# EAGLE design SwitchDemoElectron (EAGLE 9.4.0)
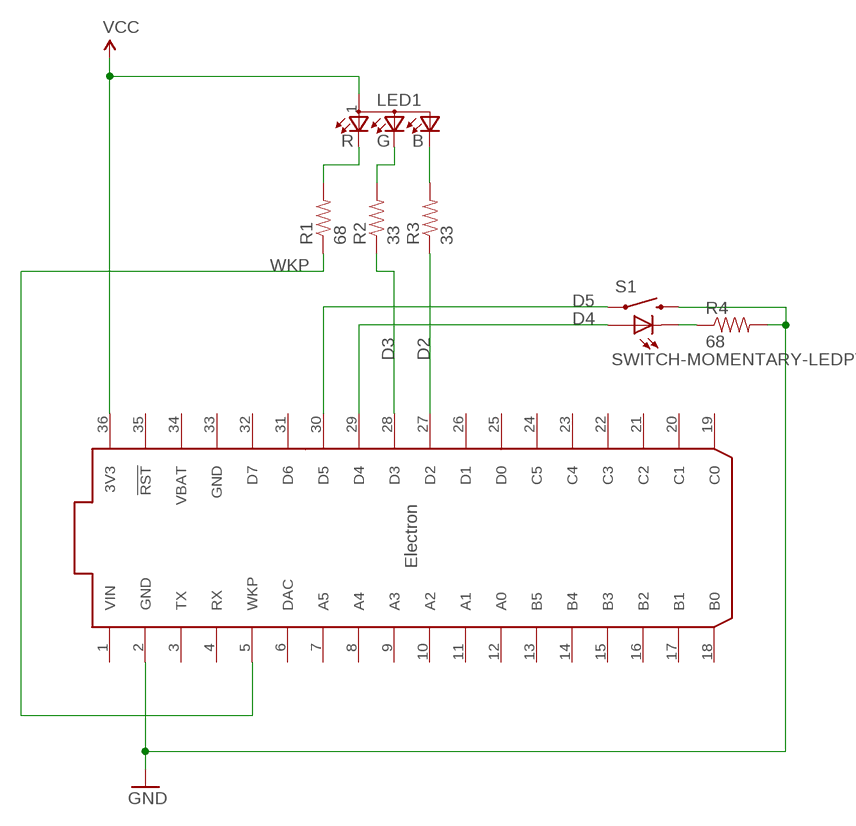
[diagram p0: schematic, sheet 1]

## Parts
LED1  LED-RGB-CREE-SMD  [LED-RGB-CREE-SMD]
R1  68  RES-68-0603.DEV  [0603-RES]
R2  33  RES-33-0603.DEV  [0603-RES]
R3  33  RES-33-0603.DEV  [0603-RES]
R4  68  RES-68-0603.DEV  [0603-RES]
S1  SWITCH-MOMENTARY-LEDPTH  [TACTILE-PTH-LED-12MM]
U$1  ELECTRON_WITH_HEADERS  [ELECTRON]

## Nets
BLED: LED1.2(B) R3.2
D2: R3.1 U$1.27(D2)
D3: R2.1 U$1.28(D3)
D4: S1.A U$1.29(D4)
D5: S1.4 U$1.30(D5)
GLED: LED1.3(G) R2.2
GND: R4.2 S1.2 U$1.2(GND)
RLED: LED1.4(R) R1.2
SLED: R4.1 S1.C
VCC: LED1.1(A) U$1.36(3V3)
WKP: R1.1 U$1.5(WKP)
Unconnected: U$1.3(TX) U$1.4(RX) U$1.6(DAC) U$1.7(A5) U$1.8(A4) U$1.9(A3) U$1.10(A2) U$1.11(A1) U$1.12(A0) U$1.13(B5) U$1.14(B4) U$1.15(B3) U$1.16(B2) U$1.17(B1) U$1.18(B0) U$1.19(C0) U$1.20(C1) U$1.21(C2) U$1.22(C3) U$1.23(C4) U$1.24(C5) U$1.25(D0) U$1.26(D1) U$1.31(D6) U$1.32(D7) U$1.35(!RST)

## Power pins joined to a net without a drawn wire
GND: U$1.33(GND)
VBAT: U$1.34(VBAT)
VIN: U$1.1(VIN)

## Library data of the parts
LED1 = rickk2:LED-RGB-CREE-SMD: LED RGB DIFFUSED 4SMD $ 0.35 Cree CLMVB-FKA-CFHEHLCBB7A363 2mm 4-PLCC common anode RGB LED https://www.digikey.com/product-detail/en/cree-inc/CLMVB-FKA-CFHEHLCBB7A363/CLMVB-FKA-CFHEHLCBB7A363CT-ND/6138627 Red=68 ohm, Green/Blue=33 ohm @ 3.3V
R1 R4 = rickk2:RES-68-0603.DEV: https://www.digikey.com/product-detail/en/panasonic-electronic-components/ERJ-3EKF68R0V/P68.0HCT-ND/1746805 Panasonic SMD 0603 1% 1/10W
R2 R3 = rickk2:RES-33-0603.DEV: https://www.digikey.com/product-detail/en/panasonic-electronic-components/ERJ-3EKF33R0V/P33.0HCT-ND/1746765 Panasonic SMD 0603 1% 1/10W
S1 = rickk2:SWITCH-MOMENTARY-LED: EZ is for Kits. There is no tStop (covering up the top side of the pads with mask). This helps the beginner see which side they should be soldering too. Red $2.10 https://www.sparkfun.com/products/10442 Also green, blue, and white Available in orange but I don't have that one
U$1 = rickk2:ELECTRON: Particle Electron footprint

## Board
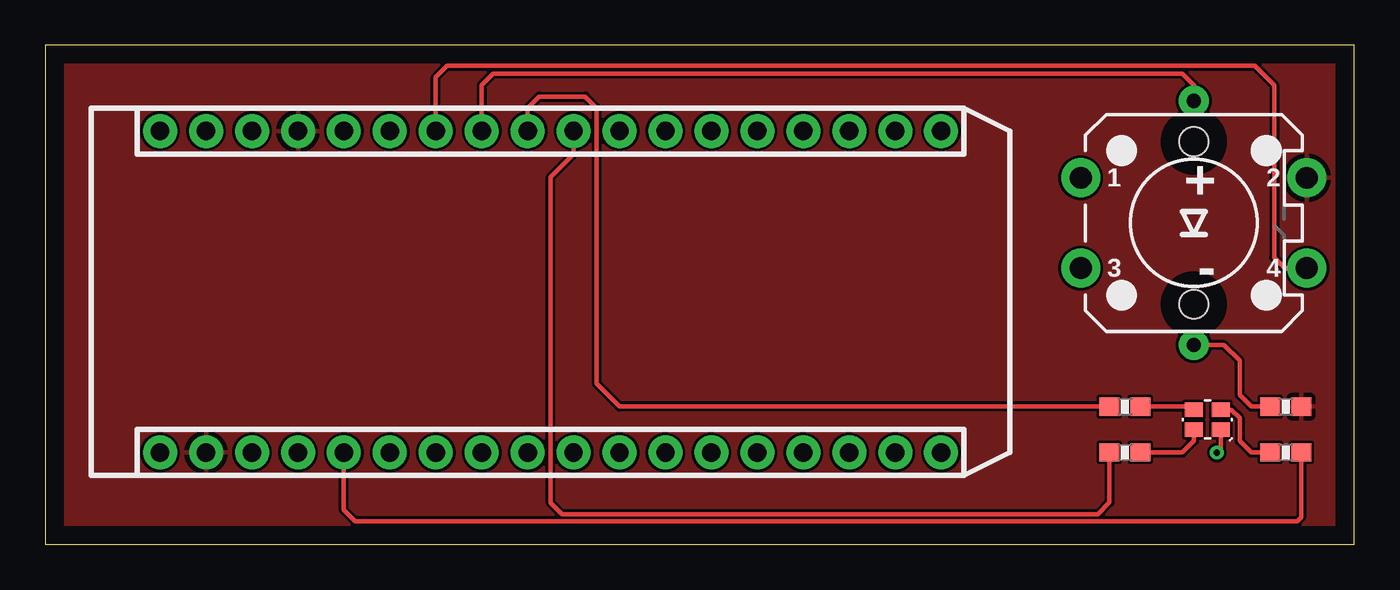
[diagram p1: board, top side]
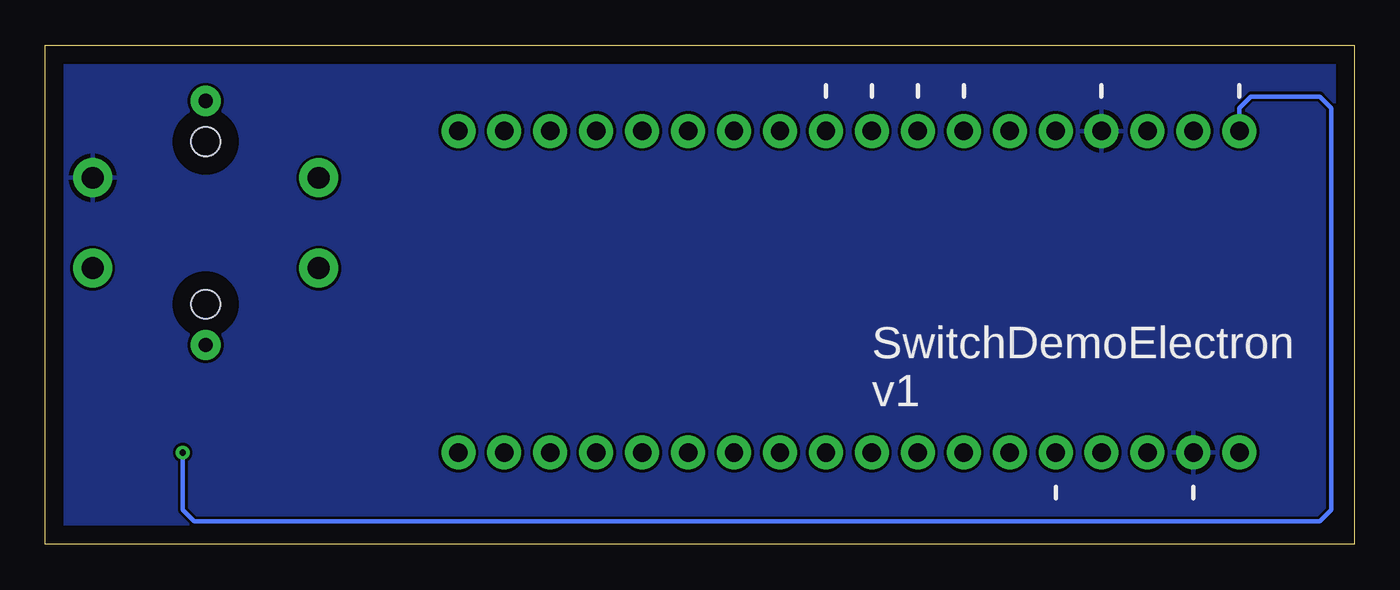
[diagram p2: board, bottom side, seen from below]

Size 72.37 x 27.61 mm. Coordinates in mm from the lower left corner, seen from the top.
Outline: 0,0 72.37,0 72.37,27.61 0,27.61 0,0
Copper layers (1*16): Top 0.035mm / dielectric 1.5mm / Bottom 0.035mm
Design rules "default": minimum track width 6mil, minimum drill 0.35mm, track to track 6mil, track to pad 6mil, pad to pad 6mil, via to via 6mil, smd to smd 6mil, copper to edge 40mil, drill to drill 6mil, minimum pad ring 10mil, minimum via ring 8mil, stop-mask expansion 4mil, vias tented up to drill 0mil, thermal gap 10mil

### Footprints (pad centres in the part's own frame; a part is rotated, then mirrored left to right if it is on the bottom)
LED-RGB-CREE-SMD = smd 1 x 0.8: 1 1.5,0; 2 0,0; 3 0,1.1; 4 1.5,1.1
0603-RES = smd 1.1 x 1: 1 -0.85,0; 2 0.85,0
TACTILE-PTH-LED-12MM = drill 1.2 pad 2.159: 1 -6.25,2.5; 2 6.25,2.5; 3 -6.25,-2.5; 4 6.25,-2.5 | drill 0.8 pad 1.676: A 0,6.75; C 0,-6.75 | hole 1.6: 0,4.5; 0,-4.5
ELECTRON = drill 1.016 pad 1.88: 1 1.27,46.99; 2 1.27,44.45; 3 1.27,41.91; 4 1.27,39.37; 5 1.27,36.83; 6 1.27,34.29; 7 1.27,31.75; 8 1.27,29.21; 9 1.27,26.67; 10 1.27,24.13; 11 1.27,21.59; 12 1.27,19.05; 13 1.27,16.51; 14 1.27,13.97; 15 1.27,11.43; 16 1.27,8.89; 17 1.27,6.35; 18 1.27,3.81; 19 19.05,3.81; 20 19.05,6.35; 21 19.05,8.89; 22 19.05,11.43; 23 19.05,13.97; 24 19.05,16.51; 25 19.05,19.05; 26 19.05,21.59; 27 19.05,24.13; 28 19.05,26.67; 29 19.05,29.21; 30 19.05,31.75; 31 19.05,34.29; 32 19.05,36.83; 33 19.05,39.37; 34 19.05,41.91; 35 19.05,44.45; 36 19.05,46.99

### Placement (x,y rotation side)
LED1  63.5,6.35 0 top
R1  68.58,5.08 180 top
R2  59.69,7.62 0 top
R3  59.69,5.08 0 top
R4  68.58,7.62 0 top
S1  63.5,17.78 0 top
U$1  53.34,3.81 90 top

### Tracks (layer width: path | path; a pad name or v marks a point on that pad's centre or on a via)
BLED
  Top 0.254: R3.2 62.87,5.08 63.5,5.71 LED1.2
D2
  Top 0.254: R3.1 58.84,2.33 58.19,1.68 28.57,1.68 27.94,2.31 27.94,20.32 29.21,21.59 U$1.27
D3
  Top 0.254: U$1.28 26.67,24.13 27.3,24.77 29.84,24.77 30.48,24.13 30.48,8.89 31.75,7.62 R2.1
D4
  Top 0.254: S1.A 63.5,25.4 62.87,26.04 24.77,26.04 24.13,25.4 U$1.29
D5
  Top 0.254: S1.4 68.62,15.28 68.58,15.24 67.94,15.88 67.94,25.4 66.88,26.47 22.23,26.47 21.59,25.83 U$1.30
GLED
  Top 0.254: R2.2 63.33,7.62 LED1.3
GND
  pour Top: 0,0 0,29.21 73.66,29.21 73.66,0
  pour Bottom: 0,0 0,30.48 74.93,30.48 74.93,0
RLED
  Top 0.254: LED1.4 65.58,7.45 66.04,6.99 66.04,5.71 66.67,5.08 R1.2
SLED
  Top 0.254: S1.C 65.17,11.03 66.04,10.16 66.04,8.26 66.67,7.62 R4.1
VCC  (via drill 0.35)
  Top 0.254: LED1.1 65,5.31 v64.77,5.08
  Bottom 0.254: v64.77,5.08 64.77,1.91 64.14,1.27 1.91,1.27 1.27,1.91 1.27,24.13 1.91,24.77 5.71,24.77 6.35,24.13 U$1.36
WKP
  Top 0.254: R1.1 69.43,1.49 69.22,1.27 17.14,1.27 16.51,1.91 U$1.5

### Text on the board
bPlace: SwitchDemoElectron / v1